# EAGLE schematic gametroller (EAGLE 9.1.0)
AUTHOR: w. boyett; CONTACT_ADDRESS: github.com/watsonboyett; CONTACT_COMPANY: Make Time Club; CONTACT_PHONE: Licensed under CC-BY-SA; REV: B
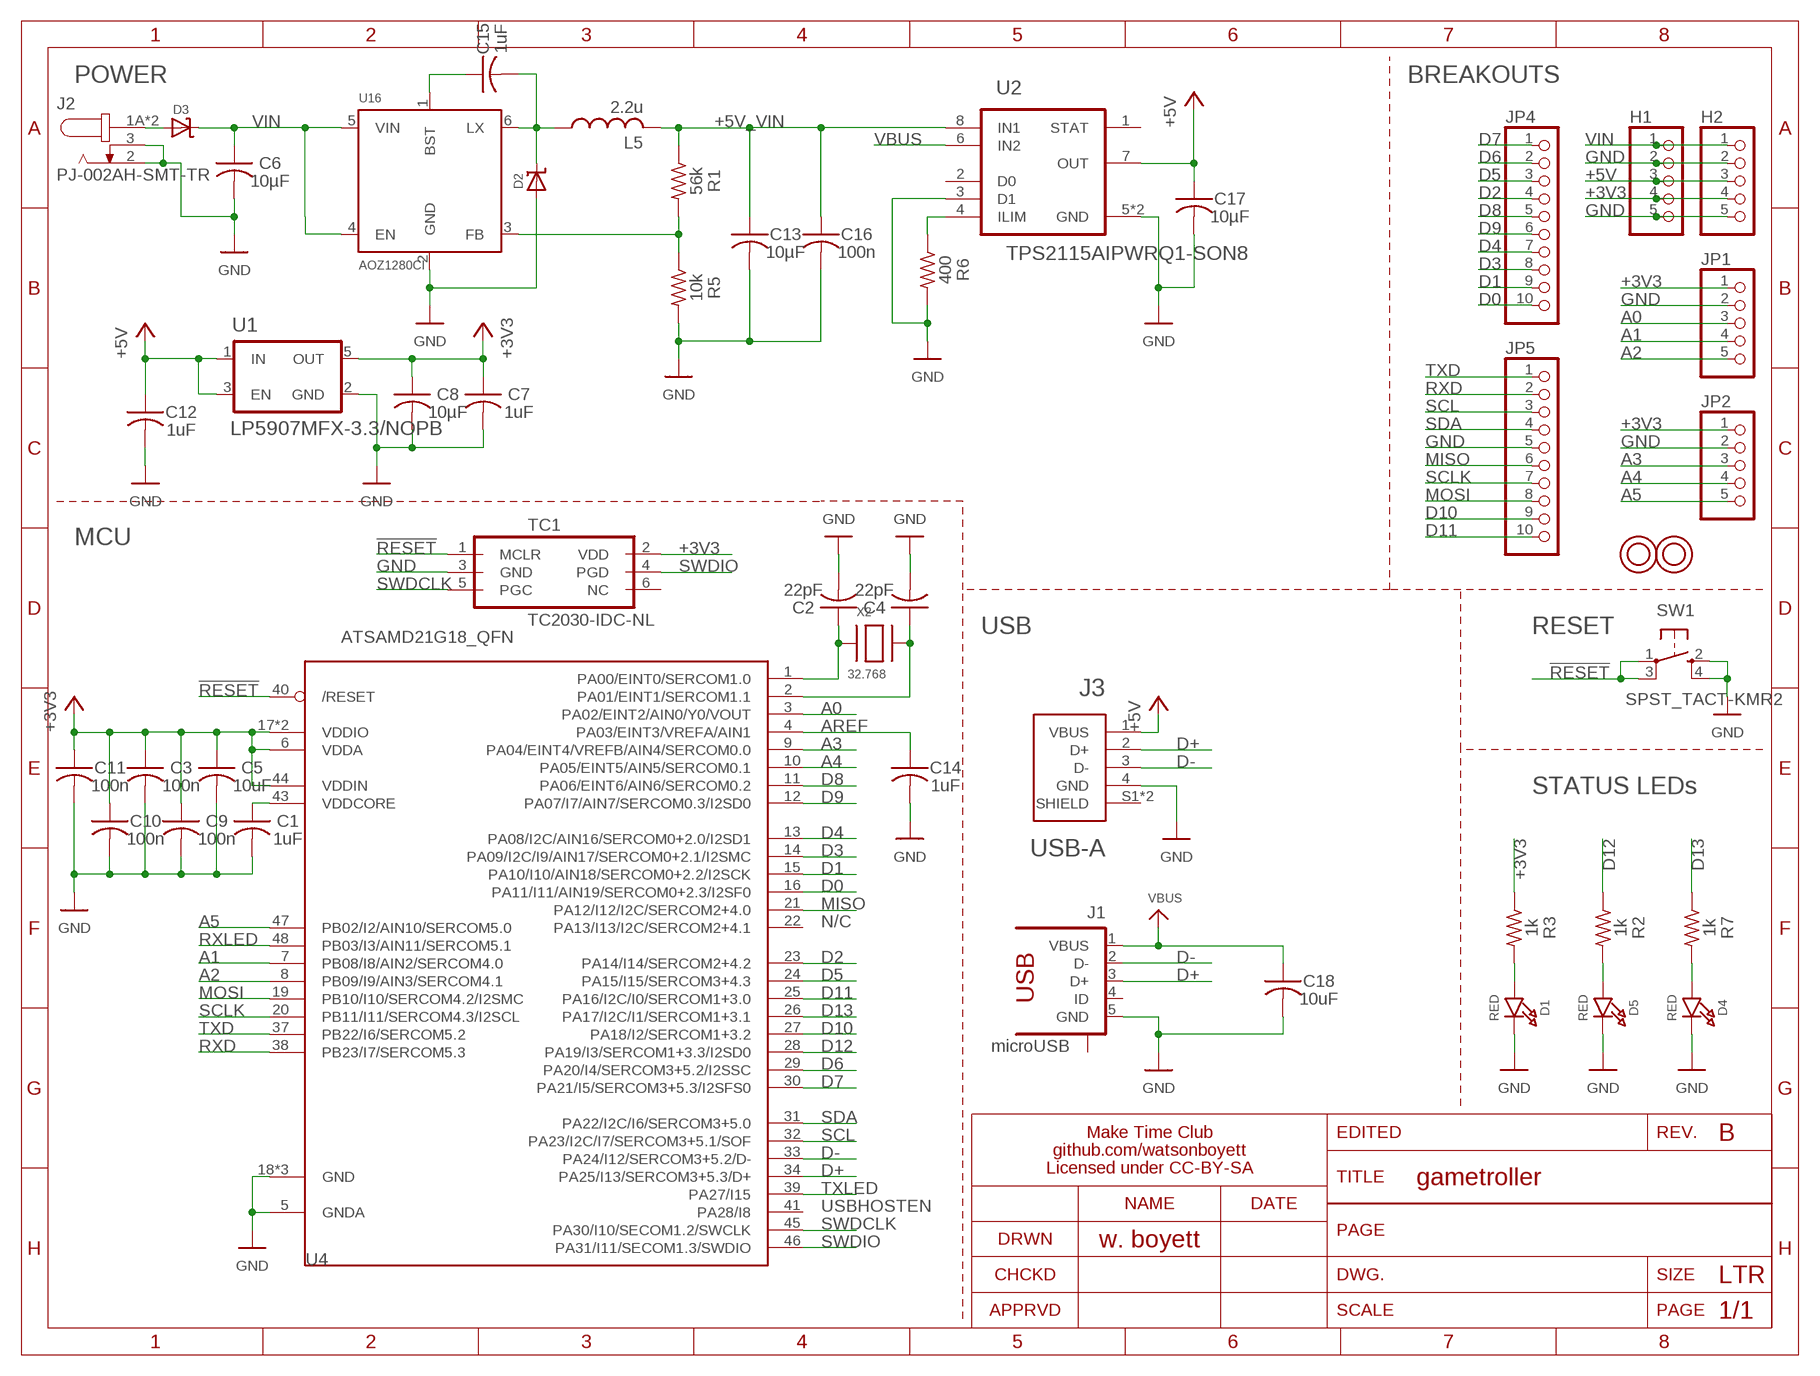
[diagram p0: schematic, sheet 1]
FRAME2 (LETTER_L): SECTION: all the things

## Parts
C1  1uF  C-USC0603  [C0603]
C2  22pF  C-USC0603  [C0603]
C3  100n  C-USC0603  [C0603]
C4  22pF  C-USC0603  [C0603]
C5  10uF  C-USC0805  [C0805]
C6  10µF  C-USC0805  [C0805]
C7  1uF  C-USC0603  [C0603]
C8  10µF  C-USC0805  [C0805]
C9  100n  C-USC0603  [C0603]
C10  100n  C-USC0603  [C0603]
C11  100n  C-USC0603  [C0603]
C12  1uF  C-USC0603  [C0603]
C13  10µF  C-USC0805  [C0805]
C14  1uF  C-USC0603  [C0603]
C15  1uF  C-USC0603  [C0603]
C16  100n  C-USC0603  [C0603]
C17  10µF  C-USC0805  [C0805]
C18  10uF  C-USC0805  [C0805]
D1  RED  LED0805_NOOUTLINE  [CHIPLED_0805_NOOUTLINE]
D2  DIODE-SCHOTTKYSOD-128  [SOD-128]
D3  DIODE-SCHOTTKYSOD-128  [SOD-128]
D4  RED  LED0805_NOOUTLINE  [CHIPLED_0805_NOOUTLINE]
D5  RED  LED0805_NOOUTLINE  [CHIPLED_0805_NOOUTLINE]
H1  PINHD-1X5-SMT  [1X05-SMT]
H2  PINHD-1X5-SMT  [1X05-SMT]
J1  microUSB  USB-MICRO  [USB-10118192-0001LF]
J2  PJ-002AH-SMT-TR  [CUI_PJ-002AH-SMT-TR]
J3  USB-A  [CUI_UJ2-AH-1-SMT]
JP1  PINHD-1X5-SMT  [1X05-SMT]
JP2  PINHD-1X5-SMT  [1X05-SMT]
JP4  PINHD-1X10-SMT  [1X10-SMT]
JP5  PINHD-1X10-SMT  [1X10-SMT]
L5  2.2u  L-USL5050M  [L5050M]
R1  56k  R-US_R0603  [R0603]
R2  1k  R-US_R0603  [R0603]
R3  1k  R-US_R0603  [R0603]
R5  10k  R-US_R0603  [R0603]
R6  400  R-US_R0603  [R0603]
R7  1k  R-US_R0603  [R0603]
SW1  SPST_TACT-KMR2  [KMR2]
TC1  TC2030-IDC-NL  [TC2030-IDC-NL]
U1  LP5907MFX-3.3/NOPB  [SOT95P280X145-5N]
U2  TPS2115AIPWRQ1-SON8  [SON65P300X300X100-9N]
U4  ATSAMD21G18_QFN  ATSAMD21J_QFP  [TQFP48_7MM]
U16  AOZ1280CI  [SOT-23-6]
U$7  TERM-7774  [TERM-7774]
U$9  TERM-7774  [TERM-7774]
X2  32.768  XTAL-3.2X1.5  [XTAL3215]

## Nets
!RESET: SW1.1(P) SW1.3(P1) TC1.1(MCLR) U4.40(/RESET)
+3V3: C3.1 C5.1 C7.1 C8.1 C9.1 C10.1 C11.1 H1.4 H2.4 JP1.1 JP2.1 R3.1 TC1.2(VDD) U1.5(OUT) U4.6(VDDA) U4.17(VDDIO) U4.36(VDDIO) U4.44(VDDIN)
+5V: C12.1 C17.1 H1.3 H2.3 J3.1(VBUS) U1.1(IN) U1.3(EN) U2.7(OUT)
+5V_VIN: C13.1 C16.1 L5.2 R1.1 U2.8(IN1)
A0: JP1.3 U4.3(PA02/EINT2/AIN0/Y0/VOUT)
A1: JP1.4 U4.7(PB08/I8/AIN2/SERCOM4.0)
A2: JP1.5 U4.8(PB09/I9/AIN3/SERCOM4.1)
A3: JP2.3 U4.9(PA04/EINT4/VREFB/AIN4/SERCOM0.0)
A4: JP2.4 U4.10(PA05/EINT5/AIN5/SERCOM0.1)
A5: JP2.5 U4.47(PB02/I2/AIN10/SERCOM5.0)
AREF: C14.1 U4.4(PA03/EINT3/VREFA/AIN1)
D0: JP4.10 U4.16(PA11/I11/AIN19/SERCOM0+2.3/I2SF0)
D1: JP4.9 U4.15(PA10/I10/AIN18/SERCOM0+2.2/I2SCK)
D2: JP4.4 U4.23(PA14/I14/SERCOM2+4.2)
D3: JP4.8 U4.14(PA09/I2C/I9/AIN17/SERCOM0+2.1/I2SMC)
D4: JP4.7 U4.13(PA08/I2C/AIN16/SERCOM0+2.0/I2SD1)
D5: JP4.3 U4.24(PA15/I15/SERCOM3+4.3)
D6: JP4.2 U4.29(PA20/I4/SERCOM3+5.2/I2SSC)
D7: JP4.1 U4.30(PA21/I5/SERCOM3+5.3/I2SFS0)
D8: JP4.5 U4.11(PA06/EINT6/AIN6/SERCOM0.2)
D9: JP4.6 U4.12(PA07/I7/AIN7/SERCOM0.3/I2SD0)
D10: JP5.9 U4.27(PA18/I2/SERCOM1+3.2)
D11: JP5.10 U4.25(PA16/I2C/I0/SERCOM1+3.0)
D12: R2.1 U4.28(PA19/I3/SERCOM1+3.3/I2SD0)
D13: R7.1 U4.26(PA17/I2C/I1/SERCOM1+3.1)
D+: J1.3(D+) J3.2(D+) U4.34(PA25/I13/SERCOM3+5.3/D+)
D-: J1.2(D-) J3.3(D-) U4.33(PA24/I12/SERCOM3+5.2/D-)
GND: C1.2 C2.2 C3.2 C4.2 C5.2 C6.2 C7.2 C8.2 C9.2 C10.2 C11.2 C12.2 C13.2 C14.2 C16.2 C17.2 C18.2 D1.C D2.A D4.C D5.C H1.2 H1.5 H2.2 H2.5 J1.5(GND) J2.2 J2.3 J3.4(GND) JP1.2 JP2.2 JP5.5 R5.2 R6.2 SW1.2(S) SW1.4(S1) TC1.3(GND) U1.2(GND) U2.3(D1) U2.5(GND) U2.9(GND) U4.5(GNDA) U4.18(GND) U4.35(GND) U4.42(GND) U16.2(GND)
LX: C15.2 D2.C L5.1 U16.6(LX)
MISO: JP5.6 U4.21(PA12/I12/I2C/SERCOM2+4.0)
MOSI: JP5.8 U4.19(PB10/I10/SERCOM4.2/I2SMC)
N$1: D5.A R2.2
N$2: D4.A R7.2
N$3: D1.A R3.2
N$5: C2.1 U4.1(PA00/EINT0/SERCOM1.0) X2.P$1
N$7: C4.1 U4.2(PA01/EINT1/SERCOM1.1) X2.P$2
N$8: C15.1 U16.1(BST)
N$9: R6.1 U2.4(ILIM)
N$11: R1.2 R5.1 U16.3(FB)
RXD: JP5.2 U4.38(PB23/I7/SERCOM5.3)
RXLED: U4.48(PB03/I3/AIN11/SERCOM5.1)
SCL: JP5.3 U4.32(PA23/I2C/I7/SERCOM3+5.1/SOF)
SCLK: JP5.7 U4.20(PB11/I11/SERCOM4.3/I2SCL)
SDA: JP5.4 U4.31(PA22/I2C/I6/SERCOM3+5.0)
SWDCLK: TC1.5(PGC) U4.45(PA30/I10/SECOM1.2/SWCLK)
SWDIO: TC1.4(PGD) U4.46(PA31/I11/SECOM1.3/SWDIO)
TXD: JP5.1 U4.37(PB22/I6/SERCOM5.2)
TXLED: U4.39(PA27/I15)
VBUS: C18.1 J1.1(VBUS) U2.6(IN2)
VDDCORE: C1.1 U4.43(VDDCORE)
VIN: C6.1 D3.C H1.1 H2.1 U16.4(EN) U16.5(VIN)
VIN_PRE: D3.A J2.1A J2.1B
Unconnected: J1.4(ID) J1.M1(S) J1.M2(S) J1.S1(S) J1.S2(S) J1.S3(S) J1.S4(S) J3.S1(SHIELD) J3.S2(SHIELD) TC1.6(NC) U2.1(STAT) U2.2(D0) U4.22(PA13/I13/I2C/SERCOM2+4.1) U4.41(PA28/I8)

## Notes on the sheet
- POWER | BREAKOUTS
- MCU
- USB | RESET
- STATUS LEDs
- N/C
- USBHOSTEN

## Library data of the parts
C1-C18 = gametroller:C-US: CAPACITOR, American symbol
D1 D4 D5 = gametroller:LED: LED 0603 - 0603 Surface Mount Package 2mA: Green LED - Low Power (3.9mcd, 2ma, 1.7Vf) - Digikey: 475-2709-2-ND Orange LED - Low Power (9.8mcd, 2ma, 1.8Vf) - Digikey: 475-1194-2-ND Red LED - Low Power (5mcd, 2ma, 1.8Vf) - Digikey: 475-1195-2-ND Yellow LED - Low Power (7mcd, 2ma, 1.8Vf) - Digikey: 475-1196-2-ND 5mA: Blue LED - Low Power (17mcd, 5ma, 2.9Vf) - Digikey: LNJ937W8CRACT-ND 0805 - 0805 Surface Mount Package 2mA: Red LED (8.8mcd, 2mA, 1.8Vf, Clear) - Low Power [Digikey: 475-2510-1-ND] Green LED (5mcd, 2mA, 1.8Vf, Clear) - Low Power [Digikey: 475-2730-1-ND] Yellow LED (11.3mcd, 2mA, 1.8Vf, Clear) - Low Power [Digikey: 475-2555-1-ND] 20mA: Red LED (104mcd, 20mA, Diffused) - LS R976 [Digikey: 475-1278-6-ND] Red LED (12mcd, 20mA, 2.0Vf, Clear) - APT2012EC [Digikey: 754-1128-1-ND] Green LED (15mcd, 20mA, 2.2Vf, Clear) - APT2012GC [Digikey: 754-1131-1-ND] Orange LED (160mcd, 20mA, 2.1Vf, Clear) - APT2012SECK [Digikey: 754-1130-1-ND] 1206 - 1206 Surface Mount Package Green LED (26mcd, 20mA, Diffused) - LG N971 [Digikey: 475-1407-6-ND] Red LED (15mcd, 20mA, Diffused) - LH N974 [Digikey: 475-1416-6-ND] Cree - Cree High-Power Surface Mount LEDs XPEBWT-L1-0000-00D50 - White 111lm 350mA 2.9Vf 6200K 110° XTEAWT-00-0000-00000LEE3 - White 114lm 350mA 2.85Vf 5000K 115° Everlight - Everlight 45-21 Series Surface Mount LEDs 45-21/QK2C-B2832AC2CB2/2T - Warm White 2000mcd 20mA 3.25Vf 3050K 120° 45-21/LK2C-B38452C4CB2/2T - Nuetral White 2000mcd 20mA 3.25Vf 4150K 120° 45-21/LK2C-B50634C6CB2/2T - Cold White 2200mcd 20mA 3.25Vf 5650K 120° PLCC2 Reverse Mount LS T77K-J1L2-1-0-2-R18-Z - Red 11.25mcd 2mA 1.8Vf 630nm 120° LO T77K-L1M2-24-Z - Orange 19.6mcd 2mA 1.8Vf 606nm 120° LY T77K-K2M1-26-Z - Yellow 15.7mcd 2mA 1.8Vf 587nm 120°
D2 D3 = gametroller:DIODE-SCHOTTKY; MFG: Toshiba Semiconductor and Storage; MPN: CMS06(TE12L,Q,M); PN-DK: CMS06QMCT-ND
H1 H2 JP1 JP2 = gametroller:PINHD-1X5: PIN HEADER
J1 = gametroller:USB-MICRO: CONN USB MICRO B RECPT SMT R/A; MFG: Amphenol; MPN: 10118192-0001LF; PN-DK: 609-4613-1-ND
J2 = gametroller:PJ-002AH-SMT-TR: Power Barrel Connector Jack 2.00mm ID (0.079"), 5.50mm OD (0.217"); MFG: CUI; MPN: PJ-002AH-SMT-TR; PN-DK: CP-002AHPJCT-ND
J3 = gametroller:USB-A: USB - A USB 2.0 Receptacle Connector; MFG: CUI; MPN: UJ2-AH-1-SMT-TR; PN-DK: 102-4133-1-ND
JP4 JP5 = gametroller:PINHD-1X10: PIN HEADER
L5 = gametroller:L-US: INDUCTOR, American symbol; PN-DK: 240-2714-1-ND
R1-R3 R5-R7 = gametroller:R-US_: RESISTOR, American symbol
SW1 = gametroller:SPST_TACT: SMT 6mm switch, EVQQ2 series http://www.ladyada.net/library/eagle
TC1 = gametroller:TC2030-IDC: Tag-Connect In Circuit Programming & Debug Cable 6 Pin http://www.tag-connect.com; AVAILABILITY: Unavailable; DESCRIPTION: Cable Adapter 6 Pos; MF: Tag-Connect; MP: TC2030-IDC; PACKAGE: None; PRICE: None
U1 = gametroller:LP5907MFX-3.3/NOPB: IC REG LINEAR 3.3V 250MA SOT23; MFG: Texas Instruments; MPN: LP5907MFX-3.3/NOPB; PN-DK: 296-38557-1-ND
U2 = gametroller:TPS2115AIPWRQ1: AUTO-SWITCHING POWER MULTIPLEXER; MFG: Texas Instruments; MPN: TPS2115ADRBR; PN-DK: 296-23394-1-ND
U4 = gametroller:ATSAMD21J: ARM® Cortex®-M0+ SAM D21G Microcontroller IC 32-Bit 48MHz 256KB (256K x 8) FLASH; MFG: Microchip Technology; MPN: ATSAMD21G18A; PN-DK: ATSAMD21G18A-AFTCT-ND
U16 = gametroller:AOZ1280CI: IC REG BUCK ADJ 1.2A SOT23-6; MFG: Alpha & Omega Semiconductor Inc.; MPN: AOZ1280CI; PN-DK: 785-1277-1-ND
U$7 U$9 = gametroller:TERM: TERM SCREW 4-40 4 PIN PCB RA; MFG: Keystone Electronics; MPN: 7774; PN-DK: 36-7774-ND
X2 = gametroller:XTAL: Low cost SMT crystals, no capacitors included http://www.ladyada.net/library/eagle